# EAGLE design gigbrain_proto (EAGLE 5.10)
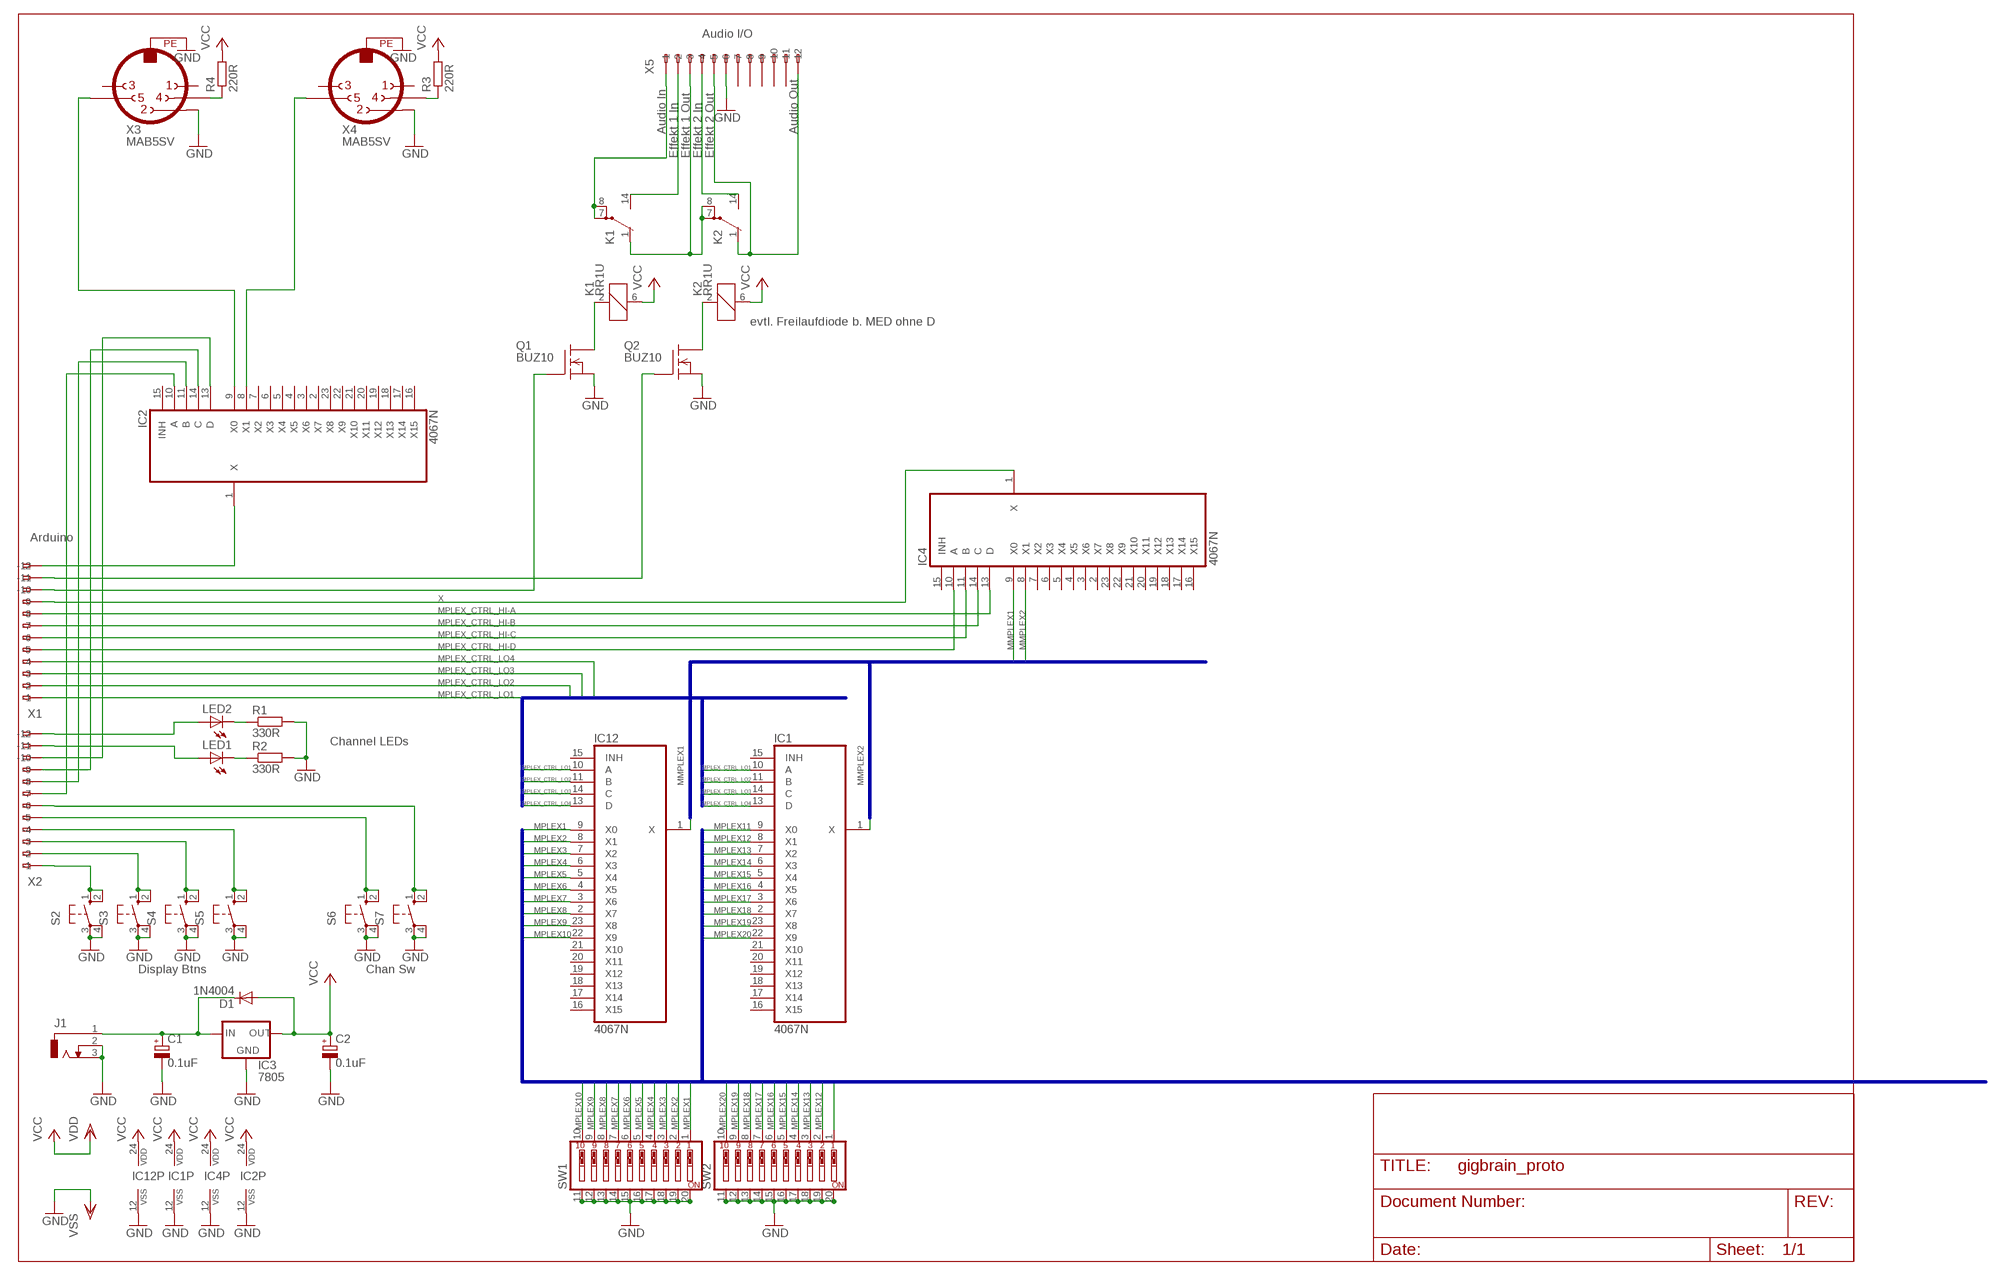
[diagram p0: schematic, sheet 1]

## Parts
C1  0.1uF  CPOL-EUE2.5-5  [E2,5-5]
C2  0.1uF  CPOL-EUE2.5-5  [E2,5-5]
D1  1N4004  [DO41-10]
IC1  4067N  [DIL24-6]
IC2  4067N  [DIL24-6]
IC3  7805  78XXL  [78XXL]
IC4  4067N  [DIL24-6]
IC12  4067N  [DIL24-6]
J1  DCJ0303  [DCJ0303]
K1  RR1U  [RR1U]
K2  RR1U  [RR1U]
LED1  LED3MM  [LED3MM]
LED2  LED3MM  [LED3MM]
Q1  BUZ10  [TO220]
Q2  BUZ10  [TO220]
R1  330R  R-EU_0204/7  [0204/7]
R2  330R  R-EU_0204/7  [0204/7]
R3  220R  R-EU_0207/10  [0207/10]
R4  220R  R-EU_0207/10  [0207/10]
S2  10-XX  [B3F-10XX]
S3  10-XX  [B3F-10XX]
S4  10-XX  [B3F-10XX]
S5  10-XX  [B3F-10XX]
S6  10-XX  [B3F-10XX]
S7  10-XX  [B3F-10XX]
SW1  SW_DIP-10  [EDG-10]
SW2  SW_DIP-10  [EDG-10]
X1  233-512  [233-512]
X2  233-512  [233-512]
X3  MAB5SV  [MAB5SV]
X4  MAB5SV  [MAB5SV]
X5  233-512  [233-512]

## Nets
GND: C1.- C2.- IC1.12(VSS) IC2.12(VSS) IC3.GND IC4.12(VSS) IC12.12(VSS) J1.2 J1.3 Q1.3(S) Q2.3(S) R1.2 R2.2 S2.3(P) S2.4(P1) S3.3(P) S3.4(P1) S4.3(P) S4.4(P1) S5.3(P) S5.4(P1) S6.3(P) S6.4(P1) S7.3(P) S7.4(P1) SW1.11 SW1.12 SW1.13 SW1.14 SW1.15 SW1.16 SW1.17 SW1.18 SW1.19 SW1.20 SW2.11 SW2.12 SW2.13 SW2.14 SW2.15 SW2.16 SW2.17 SW2.18 SW2.19 SW2.20 X3.2 X3.PE X4.2 X4.PE X5.A6(-6) X5.B6(B-6) ; supply symbol labelled VSS
MMPLEX1: IC4.9(X0) IC12.1(X)
MMPLEX2: IC1.1(X) IC4.8(X1)
MPLEX1: IC12.9(X0) SW1.1
MPLEX2: IC12.8(X1) SW1.2
MPLEX3: IC12.7(X2) SW1.3
MPLEX4: IC12.6(X3) SW1.4
MPLEX5: IC12.5(X4) SW1.5
MPLEX6: IC12.4(X5) SW1.6
MPLEX7: IC12.3(X6) SW1.7
MPLEX8: IC12.2(X7) SW1.8
MPLEX9: IC12.23(X8) SW1.9
MPLEX10: IC12.22(X9) SW1.10
MPLEX11: IC1.9(X0) SW2.1
MPLEX12: IC1.8(X1) SW2.2
MPLEX13: IC1.7(X2) SW2.3
MPLEX14: IC1.6(X3) SW2.4
MPLEX15: IC1.5(X4) SW2.5
MPLEX16: IC1.4(X5) SW2.6
MPLEX17: IC1.3(X6) SW2.7
MPLEX18: IC1.2(X7) SW2.8
MPLEX19: IC1.23(X8) SW2.9
MPLEX20: IC1.22(X9) SW2.10
MPLEX_CTRL_LO1: IC1.10(A) IC12.10(A) X1.A1(-1) X1.B1(B-1)
MPLEX_CTRL_LO2: IC1.11(B) IC12.11(B) X1.A2(-2) X1.B2(B-2)
MPLEX_CTRL_LO3: IC1.14(C) IC12.14(C) X1.A3(-3) X1.B3(B-3)
MPLEX_CTRL_LO4: IC1.13(D) IC12.13(D) X1.A4(-4) X1.B4(B-4)
N$1: IC4.10(A) X1.A5(-5) X1.B5(B-5)
N$2: IC4.11(B) X1.A6(-6) X1.B6(B-6)
N$3: IC4.14(C) X1.A7(-7) X1.B7(B-7)
N$4: IC4.13(D) X1.A8(-8) X1.B8(B-8)
N$5: C1.+ D1.C IC3.IN J1.1
N$6: IC2.8(X1) X4.5
N$7: S2.1(S) S2.2(S1) X2.A1(-1) X2.B1(B-1)
N$8: S3.1(S) S3.2(S1) X2.A2(-2) X2.B2(B-2)
N$9: S4.1(S) S4.2(S1) X2.A3(-3) X2.B3(B-3)
N$10: S5.1(S) S5.2(S1) X2.A4(-4) X2.B4(B-4)
N$11: S6.1(S) S6.2(S1) X2.A5(-5) X2.B5(B-5)
N$12: S7.1(S) S7.2(S1) X2.A6(-6) X2.B6(B-6)
N$13: R4.1 X3.4
N$14: R3.1 X4.4
N$15: IC2.9(X0) X3.5
N$16: IC2.1(X) X1.A12(-12) X1.B12(B-12)
N$17: IC2.10(A) X2.A7(-7) X2.B7(B-7)
N$18: IC2.11(B) X2.A8(-8) X2.B8(B-8)
N$19: K2.1(2:O) X5.A5(-5) X5.A12(-12) X5.B5(B-5) X5.B12(B-12)
N$20: Q1.1(G) X1.A10(-10) X1.B10(B-10)
N$21: IC2.14(C) X2.A9(-9) X2.B9(B-9)
N$22: IC2.13(D) X2.A10(-10) X2.B10(B-10)
N$23: K1.2 Q1.2(D)
N$24: K2.2 Q2.2(D)
N$25: LED2.A X2.A12(-12) X2.B12(B-12)
N$26: LED1.A X2.A11(-11) X2.B11(B-11)
N$27: Q2.1(G) X1.A11(-11) X1.B11(B-11)
N$28: K1.7(2:P) K1.8(2:P) X5.A1(-1) X5.B1(B-1)
N$29: K1.1(2:O) K2.7(2:P) K2.8(2:P) X5.A3(-3) X5.B3(B-3)
N$30: K1.14(2:S) X5.A2(-2) X5.B2(B-2)
N$31: K2.14(2:S) X5.A4(-4) X5.B4(B-4)
N$32: LED2.K(C) R1.1
N$33: LED1.K(C) R2.1
VCC: C2.+ D1.A IC1.24(VDD) IC2.24(VDD) IC3.OUT IC4.24(VDD) IC12.24(VDD) K1.6 K2.6 R3.2 R4.2 ; supply symbol labelled VDD
X: IC4.1(X) X1.A9(-9) X1.B9(B-9)
Unconnected: IC1.15(INH) IC1.16(X15) IC1.17(X14) IC1.18(X13) IC1.19(X12) IC1.20(X11) IC1.21(X10) IC2.2(X7) IC2.3(X6) IC2.4(X5) IC2.5(X4) IC2.6(X3) IC2.7(X2) IC2.15(INH) IC2.16(X15) IC2.17(X14) IC2.18(X13) IC2.19(X12) IC2.20(X11) IC2.21(X10) IC2.22(X9) IC2.23(X8) IC4.2(X7) IC4.3(X6) IC4.4(X5) IC4.5(X4) IC4.6(X3) IC4.7(X2) IC4.15(INH) IC4.16(X15) IC4.17(X14) IC4.18(X13) IC4.19(X12) IC4.20(X11) IC4.21(X10) IC4.22(X9) IC4.23(X8) IC12.15(INH) IC12.16(X15) IC12.17(X14) IC12.18(X13) IC12.19(X12) IC12.20(X11) IC12.21(X10) X3.1 X3.3 X4.1 X4.3 X5.A7(-7) X5.A8(-8) X5.A9(-9) X5.A10(-10) X5.A11(-11) X5.B7(B-7) X5.B8(B-8) X5.B9(B-9) X5.B10(B-10) X5.B11(B-11)

## Buses
MPLEX[1..160]
MPLEX_CTRL_LO[1..4]
MMPLEX[1..10]

## Notes on the sheet
- Audio I/O
- Audio In | Audio Out
- Effekt 1 In | Effekt 1 Out | Effekt 2 In | Effekt 2 Out
- evtl. Freilaufdiode b. MED ohne D
- Arduino
- X
- MPLEX_CTRL_HI-A
- MPLEX_CTRL_HI-B
- MPLEX_CTRL_HI-C
- MPLEX_CTRL_HI-D
- Channel LEDs
- Display Btns | Chan Sw

## Library data of the parts
C1 C2 = rcl:CPOL-EU: POLARIZED CAPACITOR, European symbol
D1 = diode:1N4004: DIODE general purpose rectifier, 1 A
IC1 IC2 IC4 IC12 = gigbrain_parts:4067: 16-channel ANALOG MULTIPLEXER
IC3 = v-reg:78XXL: VOLTAGE REGULATOR
J1 = con-jack:DCJ0303: DC POWER JACK Source: DCJ0303.pdf
K1 K2 = relay:RR1U: RELAY reed, polarity, 1 x switch with shield
LED1 LED2 = led:LED: LED OSRAM: - CHIPLED LG R971, LG N971, LY N971, LG Q971, LY Q971, LO R971, LY R971 LH N974, LH R974 LS Q976, LO Q976, LY Q976 LO Q996 - Hyper CHIPLED LW Q18S LB Q993, LB Q99A, LB R99A - SideLED LS A670, LO A670, LY A670, LG A670, LP A670 LB A673, LV A673, LT A673, LW A673 LH A674 LY A675 LS A676, LA A676, LO A676, LY A676, LW A676 LS A679, LY A679, LG A679 - Hyper Micro SIDELED® LS Y876, LA Y876, LO Y876, LY Y876 LT Y87S - SmartLED LW L88C, LW L88S LB L89C, LB L89S, LG L890 LS L89K, LO L89K, LY L89K LS L896, LA L896, LO L896, LY L896 - TOPLED LS T670, LO T670, LY T670, LG T670, LP T670 LSG T670, LSP T670, LSY T670, LOP T670, LYG T670 LG T671, LOG T671, LSG T671 LB T673, LV T673, LT T673, LW T673 LH T674 LS T676, LA T676, LO T676, LY T676, LB T676, LH T676, LSB T676, LW T676 LB T67C, LV T67C, LT T67C, LS T67K, LO T67K, LY T67K, LW E67C LS E67B, LA E67B, LO E67B, LY E67B, LB E67C, LV E67C, LT E67C LW T67C LS T679, LY T679, LG T679 LS T770, LO T770, LY T770, LG T770, LP T770 LB T773, LV T773, LT T773, LW T773 LH T774 LS E675, LA E675, LY E675, LS T675 LS T776, LA T776, LO T776, LY T776, LB T776 LHGB T686 LT T68C, LB T68C - Hyper Mini TOPLED® LB M676 - Mini TOPLED Santana® LG M470 LS M47K, LO M47K, LY M47K Source: http://www.osram.convergy.de LUXEON: - LUMILED® LXK2-PW12-R00, LXK2-PW12-S00, LXK2-PW14-U00, LXK2-PW14-V00 LXK2-PM12-R00, LXK2-PM12-S00, LXK2-PM14-U00 LXK2-PE12-Q00, LXK2-PE12-R00, LXK2-PE12-S00, LXK2-PE14-T00, LXK2-PE14-U00 LXK2-PB12-K00, LXK2-PB12-L00, LXK2-PB12-M00, LXK2-PB14-N00, LXK2-PB14-P00, LXK2-PB14-Q00 LXK2-PR12-L00, LXK2-PR12-M00, LXK2-PR14-Q00, LXK2-PR14-R00 LXK2-PD12-Q00, LXK2-PD12-R00, LXK2-PD12-S00 LXK2-PH12-R00, LXK2-PH12-S00 LXK2-PL12-P00, LXK2-PL12-Q00, LXK2-PL12-R00 Source: www.luxeon.com KINGBRIGHT: KA-3528ASYC Source: www.kingbright.com
Q1 Q2 = transistor-fet:BUZ10: N-Channel Enhancement MOSFET 50V; 20A; 0,080Ohm
R1-R4 = rcl:R-EU_: RESISTOR, European symbol
S2-S7 = switch-omron:10-XX: OMRON SWITCH
SW1 SW2 = special:SW_DIP-10: DIP SWITCH
X1 X2 X5 = con-wago:233-512: WAGO Cage Clamp
X3 X4 = con-hirschmann:MAB5SV: Female CONNECTOR 5 pins 90 deg. with shield, vertical (DIN41524)

## Board
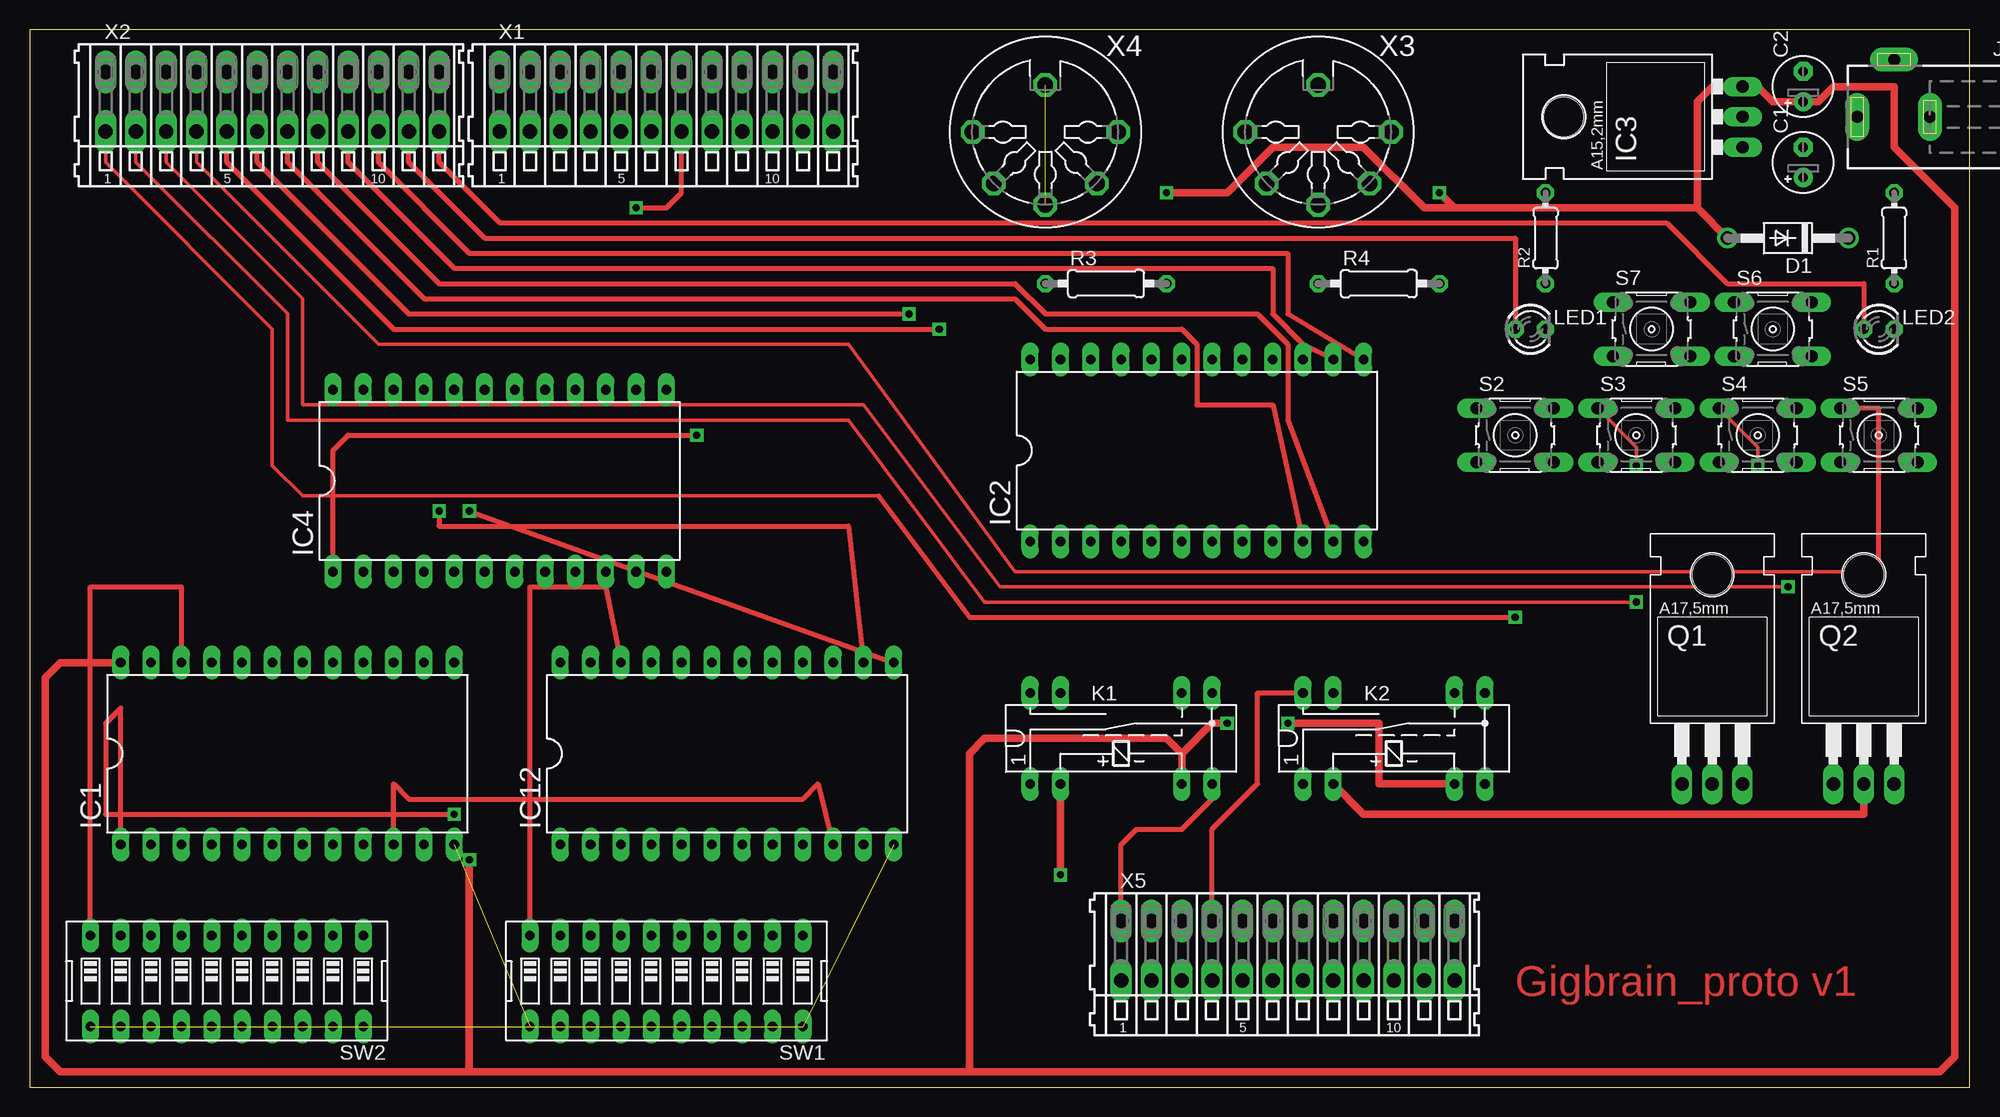
[diagram p1: board, top side]
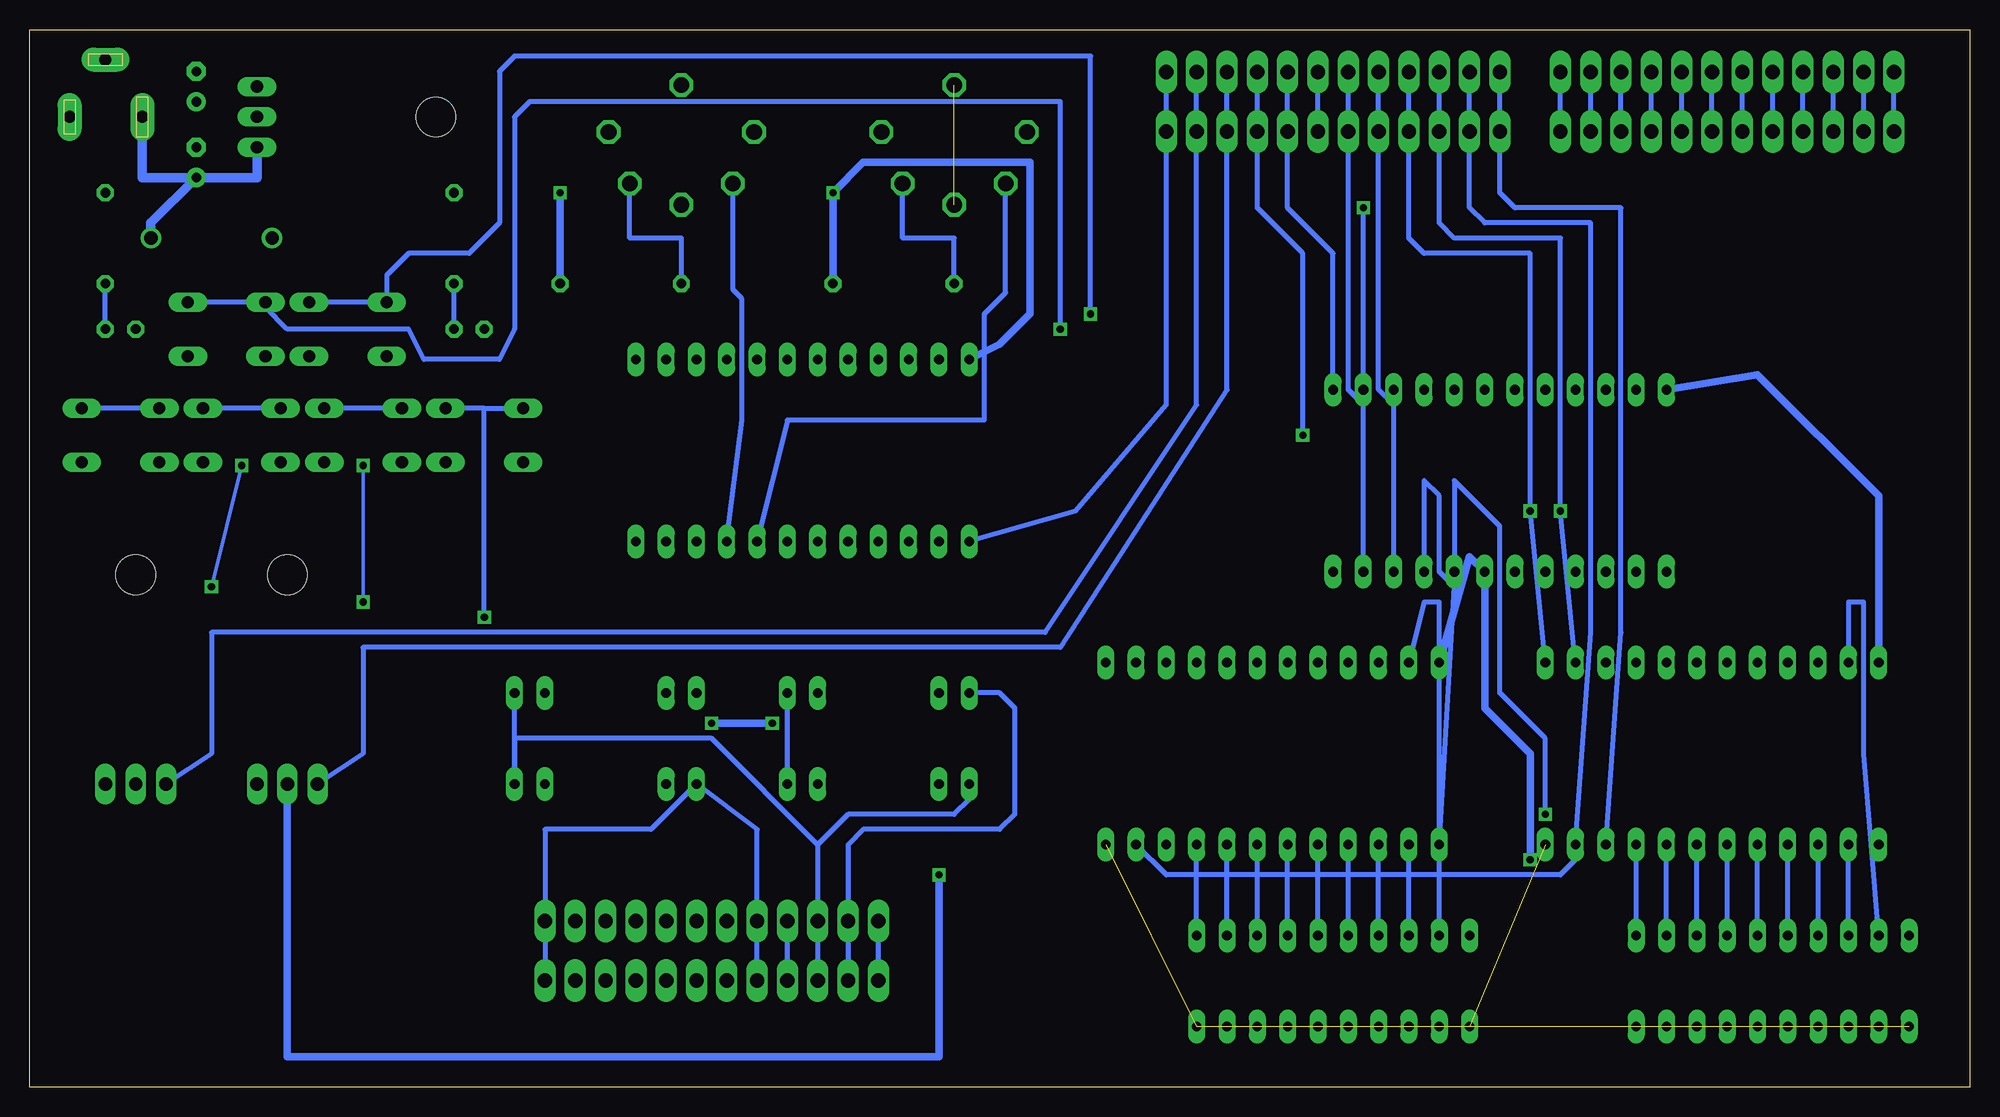
[diagram p2: board, bottom side, seen from below]

Size 162.54 x 88.57 mm. Coordinates in mm from the lower left corner, seen from the top.
Outline: 0,0 162.54,0 162.54,88.57 0,88.57 0,0
Copper layers (1*16): Top 0.035mm / dielectric 1.5mm / Bottom 0.035mm
Design rules "SparkFun": minimum track width 8mil, minimum drill 20mil, track to track 8mil, track to pad 8mil, pad to pad 8mil, via to via 8mil, smd to smd 8mil, copper to edge 10mil, drill to drill 8mil, minimum pad ring 12mil, minimum via ring 10mil, stop-mask expansion 4mil, vias tented up to drill 25mil, thermal gap 10mil

### Footprints (pad centres in the part's own frame; a part is rotated, then mirrored left to right if it is on the bottom)
E2,5-5 = drill 0.813 pad 1.6 round: + -1.27,0 | drill 0.813 pad 1.6 octagon: - 1.27,0
DO41-10 = drill 1.118 round: A 5.08,0; C -5.08,0
DIL24-6 = drill 0.813 long: 1 -13.97,-7.62; 2 -11.43,-7.62; 3 -8.89,-7.62; 4 -6.35,-7.62; 5 -3.81,-7.62; 6 -1.27,-7.62; 7 1.27,-7.62; 8 3.81,-7.62; 9 6.35,-7.62; 10 8.89,-7.62; 11 11.43,-7.62; 12 13.97,-7.62; 13 13.97,7.62; 14 11.43,7.62; 15 8.89,7.62; 16 6.35,7.62; 17 3.81,7.62; 18 1.27,7.62; 19 -1.27,7.62; 20 -3.81,7.62; 21 -6.35,7.62; 22 -8.89,7.62; 23 -11.43,7.62; 24 -13.97,7.62
78XXL = drill 1.016 long: GND 0,-3.81; IN -2.54,-3.81; OUT 2.54,-3.81 | hole 3.302: 0,11.176
DCJ0303 = drill 1 pad 2 long: 1 0,3.1; 2 4.8,0; 3 0,-3
RR1U = drill 0.813 long: 1 -7.62,-3.81; 2 -5.08,-3.81; 6 5.08,-3.81; 7 7.62,-3.81; 8 7.62,3.81; 9 5.08,3.81; 13 -5.08,3.81; 14 -7.62,3.81
LED3MM = drill 0.813 octagon: A -1.27,0; K 1.27,0
TO220 = drill 1.118 long: 1 -2.54,-6.35; 2 0,-6.35; 3 2.54,-6.35 | hole 3.302: 0,11.176
0204/7 = drill 0.813 octagon: 1 -3.81,0; 2 3.81,0
0207/10 = drill 0.813 octagon: 1 -5.08,0; 2 5.08,0
B3F-10XX = drill 1.016 long: 1 -3.251,2.261; 2 3.251,2.261; 3 -3.251,-2.261; 4 3.251,-2.261
EDG-10 = drill 0.813 long: 1 -11.43,-3.81; 2 -8.89,-3.81; 3 -6.35,-3.81; 4 -3.81,-3.81; 5 -1.27,-3.81; 6 1.27,-3.81; 7 3.81,-3.81; 8 6.35,-3.81; 9 8.89,-3.81; 10 11.43,-3.81; 11 11.43,3.81; 12 8.89,3.81; 13 6.35,3.81; 14 3.81,3.81; 15 1.27,3.81; 16 -1.27,3.81; 17 -3.81,3.81; 18 -6.35,3.81; 19 -8.89,3.81; 20 -11.43,3.81
233-512 = drill 1.2 long: A1 -13.97,2.5; A2 -11.43,2.5; A3 -8.89,2.5; A4 -6.35,2.5; A5 -3.81,2.5; A6 -1.27,2.5; A7 1.27,2.5; A8 3.81,2.5; A9 6.35,2.5; A10 8.89,2.5; A11 11.43,2.5; A12 13.97,2.5; B1 -13.97,-2.5; B2 -11.43,-2.5; B3 -8.89,-2.5; B4 -6.35,-2.5; B5 -3.81,-2.5; B6 -1.27,-2.5; B7 1.27,-2.5; B8 3.81,-2.5; B9 6.35,-2.5; B10 8.89,-2.5; B11 11.43,-2.5; B12 13.97,-2.5
MAB5SV = drill 1.321 octagon: 1 6.096,0; 2 0,-6.096; 3 -6.096,0; 4 4.318,-4.318; 5 -4.318,-4.318; PE 0,3.937

### Placement (x,y rotation side)
C1  148.59,77.47 90 top
C2  148.59,83.82 90 top
D1  147.32,71.12 180 top
IC1  21.59,27.94 0 top
IC2  97.79,53.34 0 top
IC3  139.7,81.28 90 top
IC4  39.37,50.8 0 top
IC12  58.42,27.94 0 top
J1  156.21,81.28 90 top
K1  91.44,29.21 0 top
K2  114.3,29.21 0 top
LED1  125.73,63.5 0 top
LED2  154.94,63.5 0 top
Q1  140.97,31.75 0 top
Q2  153.67,31.75 0 top
R1  156.21,71.12 90 top
R2  127,71.12 90 top
R3  90.17,67.31 0 top
R4  113.03,67.31 0 top
S2  124.46,54.61 0 top
S3  134.62,54.61 0 top
S4  144.78,54.61 0 top
S5  154.94,54.61 0 top
S6  146.05,63.5 0 top
S7  135.89,63.5 0 top
SW1  53.34,8.89 180 top
SW2  16.51,8.89 180 top
X1  53.34,82.55 0 top
X2  20.32,82.55 0 top
X3  107.95,80.01 0 top
X4  85.09,80.01 0 top
X5  105.41,11.43 0 top

### Tracks (layer width: path | path; a pad name or v marks a point on that pad's centre or on a via)
GND  (22 unrouted)
MMPLEX1
  Bottom 0.406: IC12.1 43.18,41.91 44.45,43.18 44.45,49.53 45.72,50.8 IC4.9
MMPLEX2  (via drill 0.6)
  Top 0.406: v35.56,22.86 6.35,22.86 6.35,30.48 7.62,31.75 IC1.1
  Bottom 0.406: IC4.8 43.18,50.8 39.37,46.99 39.37,33.02 35.56,29.21 v35.56,22.86
MPLEX1
  Bottom 0.406: SW1.1 IC12.9
MPLEX2
  Bottom 0.406: SW1.2 IC12.8
MPLEX3
  Bottom 0.406: SW1.3 IC12.7
MPLEX4
  Bottom 0.406: SW1.4 IC12.6
MPLEX5
  Bottom 0.406: SW1.5 IC12.5
MPLEX6
  Bottom 0.406: SW1.6 IC12.4
MPLEX7
  Bottom 0.406: SW1.7 IC12.3
MPLEX8
  Bottom 0.406: SW1.8 IC12.2
MPLEX9
  Bottom 0.406: SW1.9 44.45,40.64 45.72,40.64 IC12.23
MPLEX10
  Top 0.406: SW1.10 41.91,41.91 48.26,41.91 IC12.22
MPLEX11
  Bottom 0.406: SW2.1 IC1.9
MPLEX12
  Bottom 0.406: SW2.2 IC1.8
MPLEX13
  Bottom 0.406: SW2.3 IC1.7
MPLEX14
  Bottom 0.406: SW2.4 IC1.6
MPLEX15
  Bottom 0.406: SW2.5 IC1.5
MPLEX16
  Bottom 0.406: SW2.6 IC1.4
MPLEX17
  Bottom 0.406: SW2.7 IC1.3
MPLEX18
  Bottom 0.406: SW2.8 IC1.2
MPLEX19
  Bottom 0.406: SW2.9 8.89,27.94 8.89,40.64 10.16,40.64 IC1.23
MPLEX20
  Top 0.406: IC1.22 12.7,41.91 5.08,41.91 SW2.10
MPLEX_CTRL_LO1
  Top 0.406: IC1.10 30.48,25.4 31.75,24.13 64.77,24.13 66.04,25.4 IC12.10
  Bottom 0.406: X1.A1 X1.B1 39.37,74.93 38.1,73.66 29.21,73.66 29.21,38.1 IC1.10
MPLEX_CTRL_LO2
  Bottom 0.406: X1.A2 X1.B2 41.91,73.66 40.64,72.39 31.75,72.39 31.75,38.1 IC1.11 33.02,19.05 34.29,17.78 67.31,17.78 IC12.11
MPLEX_CTRL_LO3  (via drill 0.6)
  Top 0.406: IC12.14 68.58,46.99 34.29,46.99 v34.29,48.26
  Bottom 0.406: X1.A3 X1.B3 44.45,72.39 43.18,71.12 34.29,71.12 v34.29,48.26 IC1.14
MPLEX_CTRL_LO4  (via drill 0.6)
  Top 0.406: v36.83,48.26 IC12.13
  Bottom 0.406: X1.A4 X1.B4 46.99,71.12 45.72,69.85 36.83,69.85 v36.83,48.26 IC1.13
N$1
  Bottom 0.406: X1.A5 X1.B5 49.53,58.42 48.26,57.15 IC4.10
N$2
  Bottom 0.406: X1.A6 X1.B6 52.07,58.42 50.8,57.15 IC4.11
N$3  (via drill 0.6)
  Top 0.406: v50.8,73.66 53.34,73.66 54.61,74.93 X1.B7
  Bottom 0.406: X1.B7 X1.A7 | IC4.14 v50.8,73.66
N$4
  Bottom 0.406: X1.A8 X1.B8 57.15,73.66 53.34,69.85 IC4.13
N$5
  Bottom 0.813: D1.C 152.4,72.39 C1.+ | J1.1 153.11,76.2 C1.+ | IC3.IN 143.51,76.2 C1.+
N$6
  Bottom 0.406: X4.5 80.77,66.55 82.55,64.77 82.55,55.88 99.06,55.88 IC2.8
N$7  (via drill 0.6)
  Top 0.305: X2.B1 6.35,77.47 20.32,63.5 20.32,52.07 22.86,49.53 71.12,49.53
  Top 0.406: 71.12,49.53 78.74,39.37 v124.46,39.37
  Bottom 0.406: X2.B1 X2.A1 | 124.46,56.87 S2.1 | 124.46,56.87 S2.2 | v124.46,39.37 124.46,56.87
N$8  (via drill 0.6)
  Top 0.305: S3.1 134.62,53.62 v134.62,52.07 | v134.62,40.64 80.01,40.64 68.58,55.88 21.59,55.88 21.59,64.77 8.89,77.47 X2.B2
  Bottom 0.305: v134.62,40.64 v134.62,52.07
  Bottom 0.406: X2.B2 X2.A2 | S3.1 S3.2
N$9  (via drill 0.6)
  Top 0.305: X2.B3 11.43,77.47 22.86,66.04 22.86,57.15 69.85,57.15 81.28,41.91 v147.32,41.91 | S4.1 144.78,53.62 v144.78,52.07
  Bottom 0.305: v147.32,41.91 v144.78,52.07
  Bottom 0.406: X2.B3 X2.A3 | S4.1 S4.2
N$10
  Top 0.305: X2.B4 13.97,77.47 29.21,62.23 68.58,62.23 82.55,43.18 154.94,43.18
  Top 0.406: S5.1 154.94,56.87 154.94,43.18
  Bottom 0.406: X2.B4 X2.A4 | S5.1 S5.2
N$11  (via drill 0.6)
  Top 0.406: v76.2,63.5 30.48,63.5 16.51,77.47 X2.B5
  Bottom 0.406: X2.B5 X2.A5 | S6.2 S6.1 142.8,65.33 140.97,63.5 130.81,63.5 129.54,60.96 123.19,60.96 121.92,63.5 121.92,81.28 120.65,82.55 76.2,82.55 v76.2,63.5
N$12  (via drill 0.6)
  Top 0.406: v73.66,64.77 31.75,64.77 19.05,77.47 X2.B6
  Bottom 0.406: X2.B6 X2.A6 | S7.2 S7.1 132.64,68.02 130.81,69.85 125.73,69.85 123.19,72.39 123.19,85.09 121.92,86.36 73.66,86.36 v73.66,64.77
N$13
  Bottom 0.406: X3.4 112.27,71.12 107.95,71.12 R4.1
N$14
  Bottom 0.406: X4.4 89.41,71.12 85.09,71.12 R3.1
N$15
  Bottom 0.406: X3.5 103.63,66.8 102.87,66.04 102.87,55.88 IC2.9
N$16
  Bottom 0.406: X1.A12 X1.B12 67.31,57.15 74.93,48.26 IC2.1
N$17
  Top 0.406: X2.B7 21.59,77.47 33.02,66.04 82.55,66.04 85.09,63.5 96.52,63.5 97.79,62.23 97.79,57.15 104.14,57.15 IC2.10
  Bottom 0.406: X2.B7 X2.A7
N$18
  Top 0.406: IC2.11 105.41,55.88 105.41,62.23 102.87,64.77 85.09,64.77 82.55,67.31 34.29,67.31 24.13,77.47 X2.B8
  Bottom 0.406: X2.B8 X2.A8
N$19
  Bottom 0.406: X5.B5 X5.A5 101.6,21.59 K2.1 110.49,21.59 119.38,21.59 X5.A12 X5.B12
N$20
  Bottom 0.406: X1.A10 X1.B10 62.23,58.42 76.2,36.83 134.62,36.83 134.62,27.94 Q1.1
N$21
  Top 0.406: IC2.14 106.68,62.23 104.14,64.77 104.14,68.58 35.56,68.58 26.67,77.47 X2.B9
  Bottom 0.406: X2.B9 X2.A9
N$22
  Top 0.406: IC2.13 105.41,64.77 105.41,69.85 36.83,69.85 29.21,77.47 X2.B10
  Bottom 0.406: X2.B10 X2.A10
N$23  (via drill 0.6)
  Top 0.61: v86.36,17.78 K1.2
  Bottom 0.61: Q1.2 140.97,2.54 86.36,2.54 v86.36,17.78
N$24
  Top 0.61: Q2.2 153.67,22.86 111.76,22.86 K2.2
N$25
  Top 0.406: LED2.A 153.67,67.31 142.24,67.31 137.16,72.39 39.37,72.39 34.29,77.47 X2.B12
  Bottom 0.406: X2.B12 X2.A12
N$26
  Top 0.406: LED1.A 124.46,71.12 38.1,71.12 31.75,77.47 X2.B11
  Bottom 0.406: X2.B11 X2.A11
N$27
  Bottom 0.406: X1.A11 X1.B11 64.77,57.15 77.47,38.1 147.32,38.1 147.32,27.94 Q2.1
N$28
  Top 0.406: X5.A1 91.44,20.32 92.71,21.59 96.52,21.59 99.06,24.13 K1.7
  Bottom 0.406: X5.B1 X5.A1 | K1.7 K1.8
N$29
  Bottom 0.406: X5.B3 X5.A3 96.52,20.32 | 96.52,20.32 93.98,22.86 85.09,22.86 83.82,24.13 K1.1 | 96.52,20.32 105.41,29.21 121.92,29.21 K2.7 K2.8
N$30
  Bottom 0.406: X5.B2 X5.A2 93.98,20.32 92.71,21.59 81.28,21.59 80.01,22.86 80.01,31.75 81.28,33.02 K1.14
N$31
  Top 0.406: K2.14 102.87,33.02 102.87,25.4 99.06,21.59 X5.A4
  Bottom 0.406: X5.B4 X5.A4
N$32
  Bottom 0.406: LED2.K R1.1
N$33
  Bottom 0.406: LED1.K R2.1
VCC  (via drill 0.6)
  Top 0.61: 139.7,73.66 139.7,82.55 140.97,83.82 IC3.OUT 144.78,83.82 146.05,82.55 C2.+ 149.86,82.55 151.13,83.82 156.21,83.82 156.21,78.74 161.29,73.66 161.29,2.54 160.02,1.27 78.74,1.27 | 139.7,73.66 D1.A | 119.38,73.66 116.84,73.66 111.76,78.74 104.14,78.74 100.33,74.93 v95.25,74.93 | 139.7,73.66 119.38,73.66 | 119.38,73.66 v118.11,74.93 | IC1.24 2.54,35.56 1.27,34.29 1.27,2.54 2.54,1.27 36.83,1.27 | 36.83,1.27 78.74,1.27 | 36.83,1.27 v36.83,19.05 | 96.52,27.94 K1.6 | 96.52,27.94 95.25,29.21 80.01,29.21 78.74,27.94 78.74,1.27 | K2.6 113.03,25.4 113.03,30.48 v105.41,30.48 | v100.33,30.48 99.06,30.48 96.52,27.94
  Bottom 0.61: v118.11,74.93 R4.2 | R3.2 v95.25,74.93 92.71,77.47 78.74,77.47 78.74,64.77 81.28,62.23 IC2.24 | IC4.24 17.78,59.69 7.62,49.53 IC1.24 | IC12.24 41.91,44.45 40.64,43.18 40.64,31.75 36.83,27.94 v36.83,19.05 | v100.33,30.48 v105.41,30.48
X  (via drill 0.6)
  Top 0.406: IC4.1 25.4,53.34 26.67,54.61 v55.88,54.61
  Bottom 0.406: X1.A9 X1.B9 59.69,73.66 55.88,69.85 v55.88,54.61

### Text on the board
Top: Gigbrain_proto v1